# EAGLE design LB_BIT_i33_envelope-v03(3_3) (EAGLE 6.6.0)
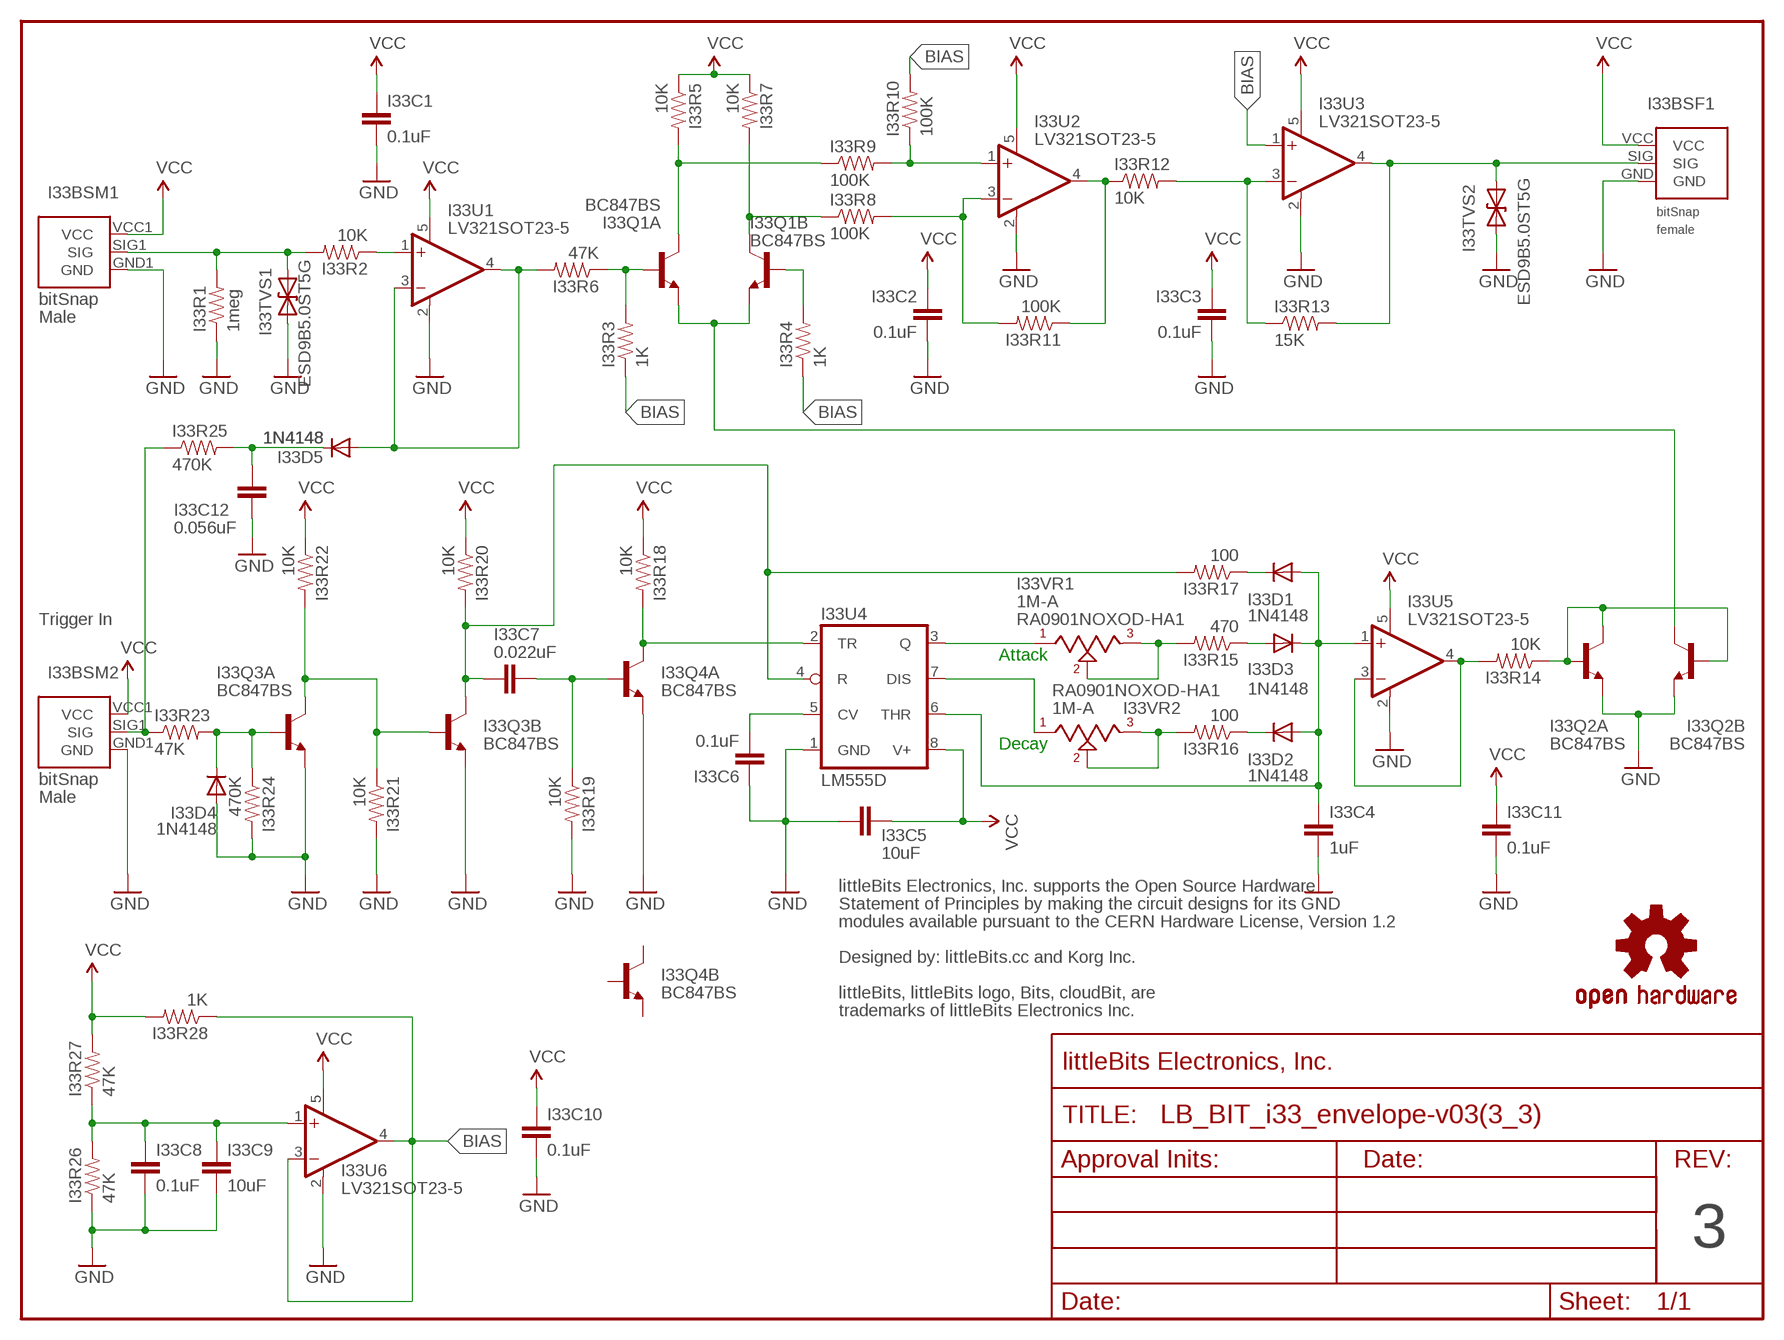
[diagram p0: schematic, sheet 1]

## Parts
I33BSF1  BITSNAP_V03_FEMALE  [BITSNAP_V03_FEMALE]
I33BSM1  BITSNAP_V03_MALE  [BITSNAP_V03_MALE]
I33BSM2  BITSNAP_V03_MALE  [BITSNAP_V03_MALE]
I33C1  0.1uF  CAPCAP-0603  [CAP-0603]
I33C2  0.1uF  CAPCAP-0603  [CAP-0603]
I33C3  0.1uF  CAPCAP-0603  [CAP-0603]
I33C4  1uF  CAPCAP-0603  [CAP-0603]
I33C5  10uF  CAPCAP-0603  [CAP-0603]
I33C6  0.1uF  CAPCAP-0603  [CAP-0603]
I33C7  0.022uF  CAPCAP-0603  [CAP-0603]
I33C8  0.1uF  CAPCAP-0603  [CAP-0603]
I33C9  10uF  CAPCAP-0603  [CAP-0603]
I33C10  0.1uF  CAPCAP-0603  [CAP-0603]
I33C11  0.1uF  CAPCAP-0603  [CAP-0603]
I33C12  0.056uF  CAPCAP-0603  [CAP-0603]
I33D1  1N4148  DIODESOD  [SOD-323]
I33D2  1N4148  DIODESOD  [SOD-323]
I33D3  1N4148  DIODESOD  [SOD-323]
I33D4  1N4148  DIODESOD  [SOD-323]
I33D5  1N4148  DIODESOD  [SOD-323]
I33Q1  BC847BS  TRANS-BJT_NPN-DUAL-BC847BS  [SOT-363_PHILLIPS]
I33Q2  BC847BS  TRANS-BJT_NPN-DUAL-BC847BS  [SOT-363_PHILLIPS]
I33Q3  BC847BS  TRANS-BJT_NPN-DUAL-BC847BS  [SOT-363_PHILLIPS]
I33Q4  BC847BS  TRANS-BJT_NPN-DUAL-BC847BS  [SOT-363_PHILLIPS]
I33R1  1meg  RESISTOR0603  [RES-0603]
I33R2  10K  RESISTOR0603  [RES-0603]
I33R3  1K  RESISTOR0603  [RES-0603]
I33R4  1K  RESISTOR0603  [RES-0603]
I33R5  10K  RESISTOR0603  [RES-0603]
I33R6  47K  RESISTOR0603  [RES-0603]
I33R7  10K  RESISTOR0603  [RES-0603]
I33R8  100K  RESISTOR0603  [RES-0603]
I33R9  100K  RESISTOR0603  [RES-0603]
I33R10  100K  RESISTOR0603  [RES-0603]
I33R11  100K  RESISTOR0603  [RES-0603]
I33R12  10K  RESISTOR0603  [RES-0603]
I33R13  15K  RESISTOR0603  [RES-0603]
I33R14  10K  RESISTOR0603  [RES-0603]
I33R15  470  RESISTOR0603  [RES-0603]
I33R16  100  RESISTOR0603  [RES-0603]
I33R17  100  RESISTOR0603  [RES-0603]
I33R18  10K  RESISTOR0603  [RES-0603]
I33R19  10K  RESISTOR0603  [RES-0603]
I33R20  10K  RESISTOR0603  [RES-0603]
I33R21  10K  RESISTOR0603  [RES-0603]
I33R22  10K  RESISTOR0603  [RES-0603]
I33R23  47K  RESISTOR0603  [RES-0603]
I33R24  470K  RESISTOR0603  [RES-0603]
I33R25  470K  RESISTOR0603  [RES-0603]
I33R26  47K  RESISTOR0603  [RES-0603]
I33R27  47K  RESISTOR0603  [RES-0603]
I33R28  1K  RESISTOR0603  [RES-0603]
I33TVS1  ESD9B5.0ST5G  DIODE-TVSSOD-923  [SOD-923]
I33TVS2  ESD9B5.0ST5G  DIODE-TVSSOD-923  [SOD-923]
I33U1  LV321SOT23-5  [SOT23-5]
I33U2  LV321SOT23-5  [SOT23-5]
I33U3  LV321SOT23-5  [SOT23-5]
I33U4  LM555D  [SO08]
I33U5  LV321SOT23-5  [SOT23-5]
I33U6  LV321SOT23-5  [SOT23-5]
I33VR1  1M-A  ALPS_POTTH  [ALPS_POT]
I33VR2  1M-A  ALPS_POTTH  [ALPS_POT]
U$1  FRAME-LETTER-OHWOHW  [FABDWG01-OHW]
U$3  OSHWCREDIT-KORG  [OSHWCREDIT-KORG]
U$9  OSHW-LOGOL  [OSHW-LOGO-L]

## Nets
BIAS: I33R3.1 I33R4.1 I33R10.2 I33R28.1 I33U3.1(+IN) I33U6.3(-IN) I33U6.4(OUT)
GND: I33BSF1.GND I33BSM1.GND1(GND) I33BSM2.GND1(GND) I33C1.2 I33C2.2 I33C3.2 I33C4.2 I33C5.1 I33C6.1 I33C8.2 I33C9.2 I33C10.2 I33C11.2 I33C12.2 I33D4.2(A) I33Q2.1(A:E) I33Q2.4(B:E) I33Q3.1(A:E) I33Q3.4(B:E) I33Q4.1(A:E) I33R1.1 I33R19.2 I33R21.2 I33R24.2 I33R26.1 I33TVS1.1(A) I33TVS2.1(A) I33U1.2(V-) I33U2.2(V-) I33U3.2(V-) I33U4.1(GND) I33U5.2(V-) I33U6.2(V-)
N$1: I33Q1.2(A:B) I33R3.2 I33R6.1
N$2: I33D5.2(A) I33R6.2 I33U1.3(-IN) I33U1.4(OUT)
N$3: I33Q2.2(A:B) I33Q2.5(B:B) I33Q2.6(A:C) I33R14.1
N$4: I33R2.1 I33U1.1(+IN)
N$5: I33Q1.6(A:C) I33R5.2 I33R9.1
N$6: I33Q1.3(B:C) I33R7.2 I33R8.1
N$7: I33Q1.1(A:E) I33Q1.4(B:E) I33Q2.3(B:C)
N$8: I33Q1.5(B:B) I33R4.2
N$9: I33R9.2 I33R10.1 I33U2.1(+IN)
N$10: I33R8.2 I33R11.2 I33U2.3(-IN)
N$11: I33R11.1 I33R12.1 I33U2.4(OUT)
N$12: I33R12.2 I33R13.1 I33U3.3(-IN)
N$13: I33Q3.5(B:B) I33Q3.6(A:C) I33R21.1 I33R22.2
N$14: I33R14.2 I33U5.3(-IN) I33U5.4(OUT)
N$15: I33C7.2 I33Q3.3(B:C) I33R17.2 I33R20.2 I33U4.4(R)
N$16: I33C4.1 I33D1.2(A) I33D2.2(A) I33D3.1(C) I33U4.6(THR) I33U5.1(+IN)
N$17: I33D3.2(A) I33R15.1
N$18: I33R15.2 I33VR1.2 I33VR1.3
N$19: I33D2.1(C) I33R16.1
N$20: I33R16.2 I33VR2.2 I33VR2.3
N$21: I33D1.1(C) I33R17.1
N$22: I33C7.1 I33Q4.2(A:B) I33R19.1
N$23: I33U4.7(DIS) I33VR2.1
N$24: I33U4.3(Q) I33VR1.1
N$25: I33BSM2.SIG1(SIG) I33R23.1 I33R25.1
N$26: I33C6.2 I33U4.5(CV)
N$27: I33D4.1(C) I33Q3.2(A:B) I33R23.2 I33R24.1
N$28: I33C8.1 I33C9.1 I33R26.2 I33R27.1 I33U6.1(+IN)
N$29: I33Q4.6(A:C) I33R18.2 I33U4.2(TR)
N$30: I33C12.1 I33D5.1(C) I33R25.2
SIG_IN: I33BSM1.SIG1(SIG) I33R1.2 I33R2.2 I33TVS1.2(C)
SIG_OUT: I33BSF1.SIG I33R13.2 I33TVS2.2(C) I33U3.4(OUT)
VCC: I33BSF1.VCC I33BSM1.VCC1(VCC) I33BSM2.VCC1(VCC) I33C1.1 I33C2.1 I33C3.1 I33C5.2 I33C10.1 I33C11.1 I33R5.1 I33R7.1 I33R18.1 I33R20.1 I33R22.1 I33R27.2 I33R28.2 I33U1.5(V+) I33U2.5(V+) I33U3.5(V+) I33U4.8(V+) I33U5.5(V+) I33U6.5(V+)
Unconnected: I33Q4.3(B:C) I33Q4.4(B:E) I33Q4.5(B:B)

## Notes on the sheet
- Trigger In | RA0901NOXOD-HA1
- Attack
- RA0901NOXOD-HA1
- Decay
- 3

## Library data of the parts
I33BSF1 = bitSnap:BITSNAP_V03_FEMALE
I33BSM1 I33BSM2 = bitSnap:BITSNAP_V03_MALE
I33C1-I33C12 = LITTLEBITS:CAP
I33D1-I33D5 = LITTLEBITS:DIODE: Diode These are standard reverse protection diodes and small signal diodes. SMA package can handle up to about 1A. SOD-323 can handle about 200mA. What the SOD-323 package when ordering, there are some mfgs out there that are 5-pin packages.
I33Q1-I33Q4 = LITTLEBITS:TRANS-BJT_NPN-DUAL
I33R1-I33R28 = LITTLEBITS:RESISTOR
I33TVS1 I33TVS2 = LITTLEBITS:DIODE-TVS: Bidirectional Transient Voltage Suppression Diode: Device conducts in avalanche mode after reaching a part dependent voltage threshold. Used for limiting voltage spikes on ESD sensitive inputs and outputs.; IEC_ESD_PROT0: +/-18kV; LB_PN: ?; MPN: ESD9B5.0ST5G; V_CLAMP: ?; V_OPERATION: 5V
I33U1-I33U3 I33U5 I33U6 = LITTLEBITS:LV321
I33U4 = LITTLEBITS:LM555D
I33VR1 I33VR2 = LITTLEBITS:ALPS_POT
U$1 = LITTLEBITS:FRAME-LETTER-OHW
U$3 = LITTLEBITS:OSHWCREDIT-KORG
U$9 = LITTLEBITS:OSHW-LOGO: Open Source Hardware Logo This logo indicates the piece of hardware it is found on incorporates a OSHW license and/or adheres to the definition of open source hardware found here: http://freedomdefined.org/OSHW

## Board
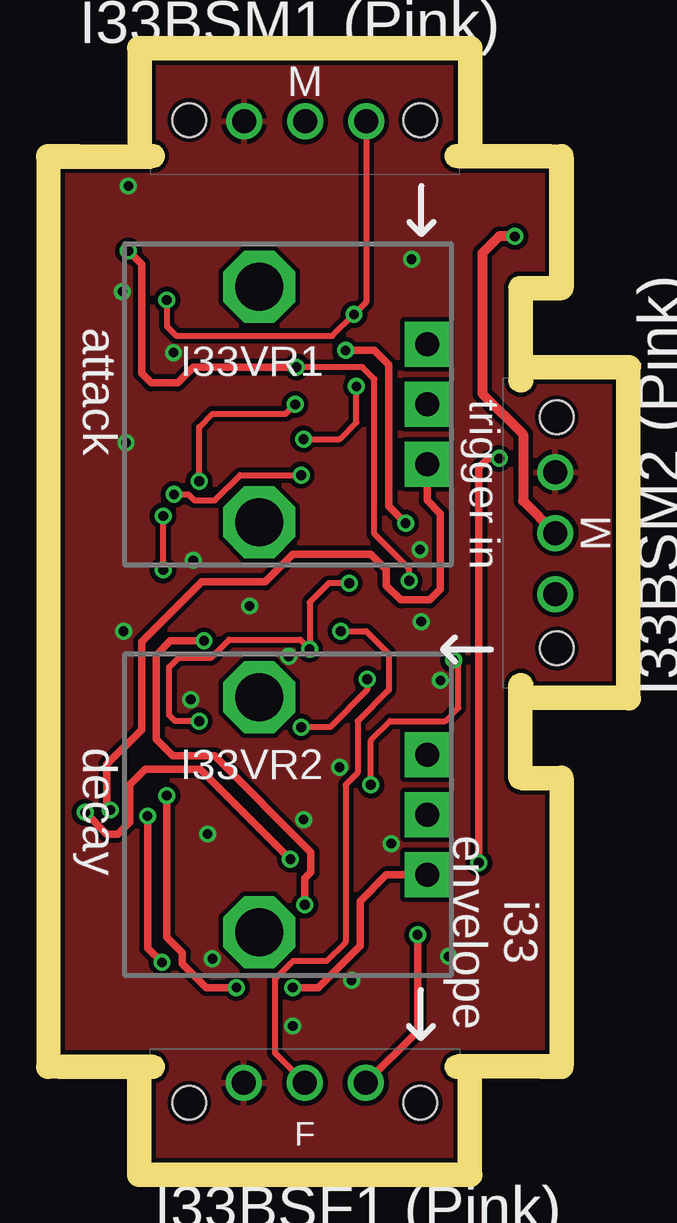
[diagram p1: board, top side]
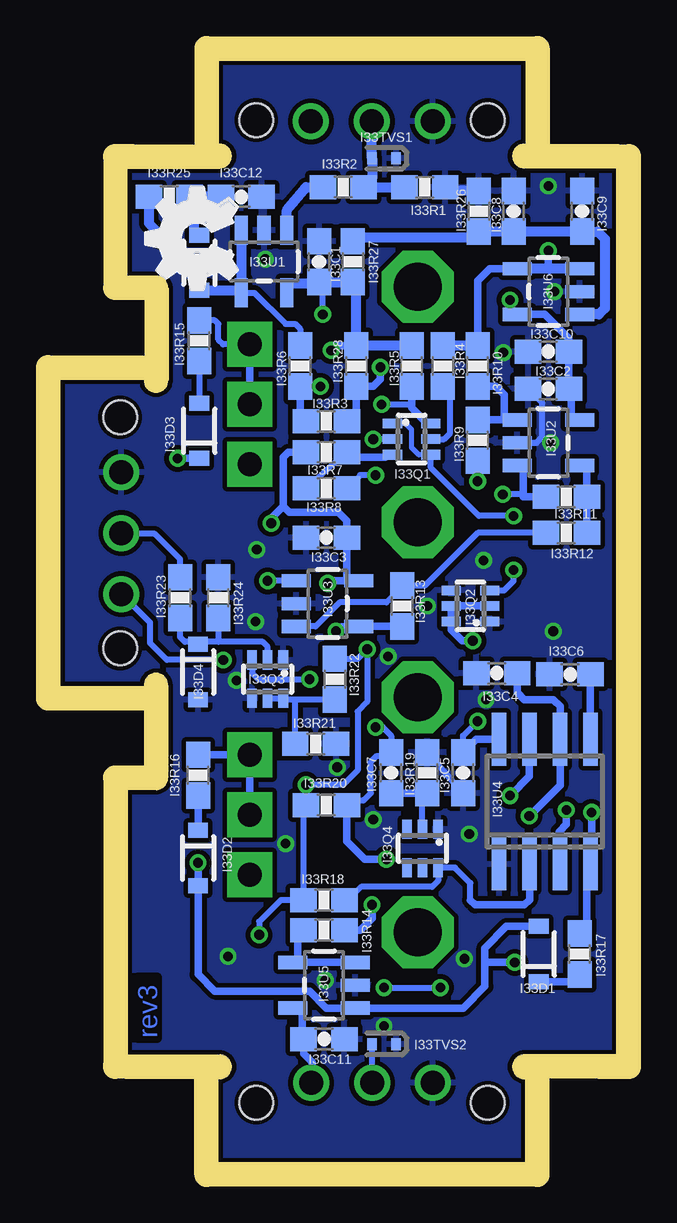
[diagram p2: board, bottom side, seen from below]

Size 23.2 x 45.95 mm. Coordinates in mm from the lower left corner, seen from the top.
Outline: 20.4,4.5 20.4,15.55 19.2,15.55 arc-90 18.7,16.05
Outline: 20.4,41.45 20.4,36.95 19.2,36.95 arc90 18.7,36.45
Outline: 0,4.5 0,41.45
Copper layers (1*16): Top 0.035mm / dielectric 1.5mm / Bottom 0.035mm
Design rules "littleBitsDRC": minimum track width 0.2mm, minimum drill 0.4mm, track to track 0.2mm, track to pad 0.2mm, pad to pad 0.2mm, via to via 0.2mm, smd to smd 0mil, copper to edge 0.2mm, drill to drill 0.2mm, minimum pad ring 0.2mm, minimum via ring 0.15mm, stop-mask expansion 0.1mm, vias tented up to drill 0mil, thermal gap 0.2mm
Milling: 9 lines

### Footprints (pad centres in the part's own frame; a part is rotated, then mirrored left to right if it is on the bottom)
BITSNAP_V03_FEMALE = drill 1: GND 3.91,3.33; SIG 6.45,3.33; VCC 8.99,3.33 | hole 1.4: 1.63,2.5; 11.27,2.5
BITSNAP_V03_MALE = drill 1: GND1 8.98,2.56; SIG1 6.44,2.56; VCC1 3.9,2.56 | hole 1.4: 11.27,2.5; 1.63,2.5
CAP-0603 = smd 1.1 x 1: 1 -0.85,0; 2 0.85,0
SOD-323 = smd 0.63 x 0.83: 1 -1.15,0; 2 1.15,0
SOT-363_PHILLIPS = smd 0.4 x 0.8: 1 -0.65,-0.8; 2 0,-0.8; 3 0.65,-0.8; 4 0.65,0.8; 5 0,0.8; 6 -0.65,0.8
RES-0603 = smd 1.1 x 1: 1 -0.85,0; 2 0.85,0
SOD-923 = smd 0.4 x 0.5: 1 -0.5,0; 2 0.5,0
SOT23-5 = smd 0.55 x 1.2: 1 -0.95,-1.3; 2 0,-1.3; 3 0.95,-1.3; 4 0.95,1.3; 5 -0.95,1.3
SO08 = smd 0.6 x 2.2: 1 -1.905,-2.6; 2 -0.635,-2.6; 3 0.635,-2.6; 4 1.905,-2.6; 5 1.905,2.6; 6 0.635,2.6; 7 -0.635,2.6; 8 -1.905,2.6
ALPS_POT = drill 1 pad 1.88 square: 1 7,-2.5; 2 7,0; 3 7,2.5 | drill 2 octagon: LUG1 0,-4.9; LUG2 0,4.9

### Placement (x,y rotation side)
I33BSF1  3.75,0 0 top
I33BSM1  16.65,45.95 180 top
I33BSM2  23.2,19.8 90 top
I33C1  12.4,37.55 90 bottom
I33C2  2.85,32.25 180 bottom
I33C3  12.1,26.05 180 bottom
I33C4  5,20.4 180 bottom
I33C5  6.4,16.25 90 bottom
I33C6  1.95,20.35 0 bottom
I33C7  9.4,16.25 90 bottom
I33C8  4.3,39.65 90 bottom
I33C9  1.45,39.65 90 bottom
I33C10  2.85,33.8 180 bottom
I33C11  12.2,5.15 0 bottom
I33C12  15.65,40.25 0 bottom
I33D1  3.25,8.7 90 bottom
I33D2  17.45,12.7 270 bottom
I33D3  17.4,30.5 90 bottom
I33D4  17.45,20.45 270 bottom
I33D5  17.4,37.5 270 bottom
I33Q1  8.55,30.15 270 bottom
I33Q2  6.1,23.2 90 bottom
I33Q3  14.55,20.15 180 bottom
I33Q4  8.1,13.1 180 bottom
I33R1  8,40.65 180 bottom
I33R2  11.4,40.65 0 bottom
I33R3  12.1,30.9 180 bottom
I33R4  7.25,33.2 270 bottom
I33R5  8.55,33.2 270 bottom
I33R6  13.2,33.2 90 bottom
I33R7  12.1,29.6 0 bottom
I33R8  12.1,28.1 0 bottom
I33R9  5.8,30.1 90 bottom
I33R10  5.8,33.2 90 bottom
I33R11  2.1,27.75 180 bottom
I33R12  2.1,26.25 180 bottom
I33R13  8.95,23.2 270 bottom
I33R14  12.2,9.7 180 bottom
I33R15  17.4,34.25 90 bottom
I33R16  17.45,16.15 90 bottom
I33R17  1.55,8.7 90 bottom
I33R18  12.2,10.95 0 bottom
I33R19  7.9,16.25 90 bottom
I33R20  12.1,14.9 0 bottom
I33R21  12.55,17.45 0 bottom
I33R22  11.75,20.15 270 bottom
I33R23  18.2,23.55 270 bottom
I33R24  16.6,23.55 90 bottom
I33R25  18.65,40.25 0 bottom
I33R26  5.75,39.65 270 bottom
I33R27  11,37.55 270 bottom
I33R28  10.85,33.2 90 bottom
I33TVS1  9.7,41.85 180 bottom
I33TVS2  9.7,4.95 180 bottom
I33U1  14.7,37.55 180 bottom
I33U2  2.85,30 270 bottom
I33U3  12.05,23.3 270 bottom
I33U4  3,15.05 0 bottom
I33U5  12.2,7.4 90 bottom
I33U6  2.85,36.3 90 bottom
I33VR1  8.3,31.6 0 top
I33VR2  8.3,14.5 0 top
U$1  57.25,3.15 0 top  (outside the outline)
U$3  -19.45,-65.45 0 top  (outside the outline)
U$8  [OSHW_FILLX150_NOTEXT]  15.81,35.56 0 top
U$9  27.75,-62.6 0 top  (outside the outline)

### Tracks (layer width: path | path; a pad name or v marks a point on that pad's centre or on a via)
BIAS  (via drill 0.41)
  Top 0.254: v14.55,24.25 14.55,24.75 13.1,26.2 13.1,32.65 12.6,33.15 v9.85,33.15
  Top 0.305: v9.85,33.15 5.55,33.15 4.9,32.5 3.8,32.5 3.4,32.9 3.4,37.45 v2.85,38
  Bottom 0.254: I33U3.1 v14.55,24.25
  Bottom 0.305: I33U6.4 5.3,37.25 5.8,36.75 I33R10.2 | I33R3.1 11,30.9 10.85,31.05 I33R28.1 10.85,32.45 10.7,32.6 10.7,32.35 10.15,32.35 9.85,32.65 v9.85,33.15 | v2.85,38 2.85,37.3 2.8,37.25
  Bottom 0.406: I33U6.3 2.8,37.25 I33U6.4 | I33R10.2 I33R4.1
GND  (via drill 0.41)
  Bottom 0.254: I33C5.1 6.5,15.5 I33R19.2 | I33U2.2 3.35,30 3.1,30.25 3.1,31.65 I33C2.2
  Bottom 0.406: I33R26.1 7,40.5 I33R1.1
  other vias: 6.35,8.5 2.6,36.3 6.15,13.7 5.55,25.1 10.15,14.3 12.15,7.6 4.73,33.76 11.65,16.48 15.85,20.1 9.7,5.7 2.65,22.15 9.53,21.1 7.9,23.2 13.8,13.3 16.2,8.6 2.85,40.7 2.75,30 14.65,37.65 15,25.55 15.05,22.55 5.45,19.3
  pour Bottom: 0,0 23.25,-0.05 23.25,45.85 0,45.9
  pour Top: 0,0 23.2,0.3 23.2,46.2 0,46.25
N$1  (via drill 0.41)
  Top 0.254: v10.15,30.15 11.65,30.15 12.35,30.85 v12.35,32.35
  Bottom 0.254: I33Q1.2 v10.15,30.15 | v12.35,32.35 I33R6.1
  Bottom 0.305: I33R6.1 13.2,31 13.1,30.9 I33R3.2
N$2
  Bottom 0.254: I33U1.4 15.1,36.25 13.8,34.95 13.4,34.95 13.2,34.75 I33R6.2
  Bottom 0.406: I33U1.3 I33U1.4 15.75,36.35 I33D5.2
N$3  (via drill 0.41)
  Top 0.305: v6,21.75 4.6,21.75 4,21.15 4,17.65 4.7,16.95 6.45,16.95 10.45,12.95 10.45,12.1 10.2,11.85 v10.2,10.75
  Bottom 0.305: I33Q2.2 I33Q2.5 I33Q2.6 6.9,22.2 6.45,21.75 v6,21.75 | v10.2,10.75 10.2,10.2 10.7,9.7 I33R14.1
N$4
  Bottom 0.406: I33U1.1 13.75,39.7 12.95,40.65 I33R2.1
N$5  (via drill 0.41)
  Top 0.254: v5.8,28.4 5.8,30.65 6.35,31.2 9.4,31.2 v9.8,31.6
  Bottom 0.254: I33R9.1 v5.8,28.4 | v9.8,31.6 8.55,31.6
  Bottom 0.305: I33Q1.6 7.9,30.8 8.55,31.45 8.55,31.6 I33R5.2
N$6
  Bottom 0.254: I33R7.2 11.35,29.55 I33R8.1
  Bottom 0.305: I33Q1.3 9.6,29.5 9.65,29.4 10.8,29.4 11.15,29.5 I33R7.2
N$7  (via drill 0.41)
  Top 0.254: v4.3,24.7 v4.3,26.95
  Bottom 0.203: I33Q1.4 8.25,29.5 8.55,29.8 8.55,30.55 8.8,30.8 I33Q1.1
  Bottom 0.254: I33Q2.3 4.7,23.85 4.3,24.25 v4.3,24.7 | v4.3,26.95 5.75,26.95 7.75,28.95 I33Q1.4
N$8
  Bottom 0.254: I33Q1.5 7.2,30.15 6.95,30.4 6.95,32.05 I33R4.2
  Bottom 0.305: 7.05,31.95 I33R4.2
N$9
  Bottom 0.305: I33R10.1 5.05,32.35 4.7,32 4.7,31.05 4.6,30.95 | I33R9.2 4.6,30.95 | 4.6,30.95 I33U2.1
N$10  (via drill 0.41)
  Top 0.254: v4.75,27.85 5.35,27.85 5.6,27.6 6.45,27.6 7.5,28.65 v10.05,28.65
  Bottom 0.254: I33U2.3 4.05,29.05 3.9,28.9 3.9,27.85 v4.75,27.85 | v10.05,28.65 10.7,28.65 I33R8.2
  Bottom 0.305: I33U2.3 3.9,29.05 3.9,28.9 3.9,27.75 I33R11.2
N$11
  Bottom 0.305: I33U2.4 1.95,29.05 2,29 1.25,29 I33R11.1 I33R12.1
N$12
  Bottom 0.254: I33R12.2 5.8,26.25 8,24.05 I33R13.1 8.95,24 9.6,23.35 11.55,23.35 12.55,22.35 I33U3.3
N$13
  Bottom 0.254: I33Q3.5 I33Q3.6 13.85,19.3 13.4,19.3 | I33R22.2 13.4,19.3 | I33R21.1 13.4,19.3
N$14
  Bottom 0.305: I33U5.3 I33U5.4 13.3,8.55 13.3,9.55 13.15,9.7 I33R14.2
N$15  (via drill 0.41)
  Top 0.254: v12.8,20.15 12.8,19.7 11.25,18.15 v10.05,18.15
  Top 0.305: v1.05,14.6 1.95,13.7 2.4,13.7 2.9,14.2 2.9,15.75 3.55,16.4 5.85,16.4 v9.6,12.65
  Bottom 0.254: I33R20.2 11,15.1 10.55,15.1 10.25,15.4 10.25,16.7 10,16.95 9.55,16.95 I33C7.2 9.4,17.8 9.75,18.15 v10.05,18.15 | I33Q3.3 15.2,20.4 14.95,20.15 v12.8,20.15
  Bottom 0.305: I33R17.2 1.25,9.9 1.25,11.55 1.09,11.71 I33U4.4 1.05,13.55 v1.05,14.6 | v9.6,12.65 10.5,12.65 11.25,13.4 I33R20.2
N$16  (via drill 0.41)
  Top 0.305: v3.65,14.45 3.65,8.95 v4.25,8.35 | v18.3,29.35 17.85,29.35 17.45,28.95 v17.45,12.5
  Bottom 0.305: 5.5,8.4 5.5,7.35 6.4,6.45 I33U5.1 12.1,6.45 12.8,7.15 16.75,7.15 17.45,7.85 I33D2.2 v17.45,12.5 | 5.5,8.4 5.5,8.95 4.6,9.85 I33D1.2 | I33C4.1 4.15,19.6 3.85,19.3 2.65,19.3 2.37,19.02 I33U4.6 2.37,15.74 v3.65,14.45 | v4.25,8.35 5.45,8.35 5.5,8.4 | I33D3.1 v18.3,29.35
N$17
  Bottom 0.254: I33R15.1 I33D3.2
N$18
  Bottom 0.254: I33VR1.3 16.4,34.1 16.6,34.3 16.6,34.95 16.75,35.1 I33R15.2
  Bottom 0.305: I33VR1.3 I33VR1.2
N$19
  Bottom 0.305: I33D2.1 I33R16.1
N$20
  Bottom 0.305: I33R16.2 I33VR2.3 I33VR2.2
N$21
  Bottom 0.305: I33R17.1 1.55,7.55 I33D1.1
N$22
  Bottom 0.254: I33Q4.2 8.1,15.2 I33R19.1
  Bottom 0.305: I33C7.1 I33R19.1
N$23  (via drill 0.41)
  Top 0.305: I33VR2.1 13.6,12 12.5,10.9 12.5,9.05 10.75,7.3 v9.7,7.3 | v7.35,7.3 6.1,7.3 5.1,8.3 5.1,8.75 4.45,9.4 v4.45,15.3
  Bottom 0.254: v9.7,7.3 v7.35,7.3
  Bottom 0.305: v4.45,15.3 3.65,16.1 3.65,17.63 I33U4.7
N$24  (via drill 0.41)
  Top 0.305: I33VR1.1 15.3,27.6 15.85,27.05 15.85,23.9 15.4,23.45 14.2,23.45 13.6,24.05 13.6,24.7 12.95,25.35 9.7,25.35 8.55,24.2 5.9,24.2 3.4,21.7 3.4,18.05 1.95,16.6 1.95,14.85 v2.1,14.7
  Bottom 0.305: v2.1,14.7 2.1,14.1 2.4,13.8 2.4,12.49 I33U4.3
N$25  (via drill 0.41)
  Top 0.406: v18.95,38.6 18.3,38.6 17.6,37.9 17.6,32.05 19.3,30.35 19.3,27.58 I33BSM2.SIG1
  Bottom 0.254: I33R23.1 18.2,25.15 19.25,26.2 20.6,26.2 I33BSM2.SIG1
  Bottom 0.406: I33R25.1 19.5,39.15 v18.95,38.6
N$26
  Bottom 0.305: I33C6.2 I33U4.5
N$27
  Bottom 0.254: I33Q3.2 14.55,21.5 14.75,21.7 16.6,21.7 | 16.6,21.7 17.4,21.7 | 17.4,21.7 I33D4.1 | I33R24.1 16.6,21.7 | 17.4,21.7 18,21.7 18.2,21.9 I33R23.2
  Bottom 0.305: 17.4,21.55 I33D4.1
N$28
  Bottom 0.406: I33R27.1 10.95,38.55 6.05,38.55 I33R26.2 I33C8.1 I33C9.1 0.8,38.8 0.5,38.5 0.5,35.6 0.75,35.35 I33U6.1
N$29
  Bottom 0.254: 6.1,10.95 6.1,11.65 6.75,12.3 I33Q4.6 7.45,11.75 7.7,11.5 10.65,11.5 11.2,10.95
  Bottom 0.305: I33R18.2 11.2,10.95 | I33U4.2 3.63,10.96 3.85,10.75 5.9,10.75 6.1,10.95
N$30
  Bottom 0.406: I33C12.1 I33R25.2 17.6,40.05 17.6,38.65 I33D5.1
SIG_IN
  Bottom 0.406: I33BSM1.SIG1 I33TVS1.2 10.2,41 I33R2.2 I33R1.2
SIG_OUT  (via drill 0.41)
  Top 0.254: v11.7,22.15 12.75,22.15 13.7,21.2 13.7,19.7 12.4,18.4 12.4,16.25 11.9,15.75 11.9,9.2 11.1,8.4 9.7,8.4 8.95,7.65 8.95,4.58 I33BSF1.SIG
  Bottom 0.254: I33BSF1.SIG I33TVS2.2 | I33U3.4 11.5,22.35 v11.7,22.15
  Bottom 0.305: I33U3.4 I33R13.2
VCC  (via drill 0.41)
  Top 0.254: I33BSM1.VCC1 12.75,35.85 v12.25,35.35 11.35,34.45 4.85,34.45 4.45,34.85 v4.45,35.95 | v12.05,24.15 11.2,24.15 10.4,23.35 v10.4,21.4 10,21.8 7.05,21.8 6.3,21.05 4.95,21.05 4.55,20.65 4.55,18.65 4.8,18.4 v5.8,18.4 | v12.95,15.75 12.95,17.6 13.75,18.4 16.05,18.4 16.6,18.95 16.6,20.75 v16.4,20.95
  Top 0.305: v14.9,9.5 14.9,5.49 I33BSF1.VCC | v11.9,33.85 13.1,33.85 13.7,33.25 13.7,27.35 v14.4,26.65
  Bottom 0.254: v12.25,35.35 12.25,36.55 I33C1.1 | I33U6.5 4.45,35.35 v4.45,35.95 | v10.4,21.4 10.4,21.45 | I33C5.2 6.4,17.8 v5.8,18.4 | I33R22.1 10.8,21 v10.4,21.4 | v10.4,21.4 10.4,19.2 10.8,18.8 10.8,16.35 11.4,15.75 v12.95,15.75 I33R20.1 13.05,14.8 I33R18.1 14,10.95 14.9,10.05 v14.9,9.5 | v16.4,20.95 18.75,20.95 19.45,21.65 19.45,22.51 I33BSM2.VCC1
  Bottom 0.305: I33U6.5 3,35.35 2,34.35 I33C10.1 I33C2.1 1.9,32.15 1.9,31 1.85,30.95 I33U2.5 | 13.9,27.35 13.65,27.1 11.6,27.1 11.25,26.75 I33C3.1 11.25,24.25 | 13.9,27.35 13.9,29.4 13.7,29.6 I33R7.1 | I33U4.8 5.85,17.65 I33C5.2 | I33BSF1.VCC 12.7,3.37 12.7,4.2 13.05,4.55 I33C11.1 13.1,5.2 13.1,6.45 I33U5.5 | I33U3.5 11.25,24.25 | 11.25,24.25 11.9,24.25 v12.05,24.15 | I33R28.2 11.7,34.05 v11.9,33.85 | v14.4,26.65 14.4,26.85 13.9,27.35
  Bottom 0.406: I33U1.5 13.75,36.6 13.7,36.65 12.45,36.65 I33C1.1 I33R27.2 11.25,36.45 11.05,36.45 10.85,36.25 I33R28.2 I33R5.1

### Text on the board
Bottom: rev3
tPlace: attack | trigger in | decay | i33 / envelope
tNames: I33BSM1 (Pink) | I33BSM2 (Pink) | I33BSF1 (Pink)
Reference: XLARGE
dxf: 3